# Altium schematic sheet Beam_Amp.SchDoc
size Tabloid
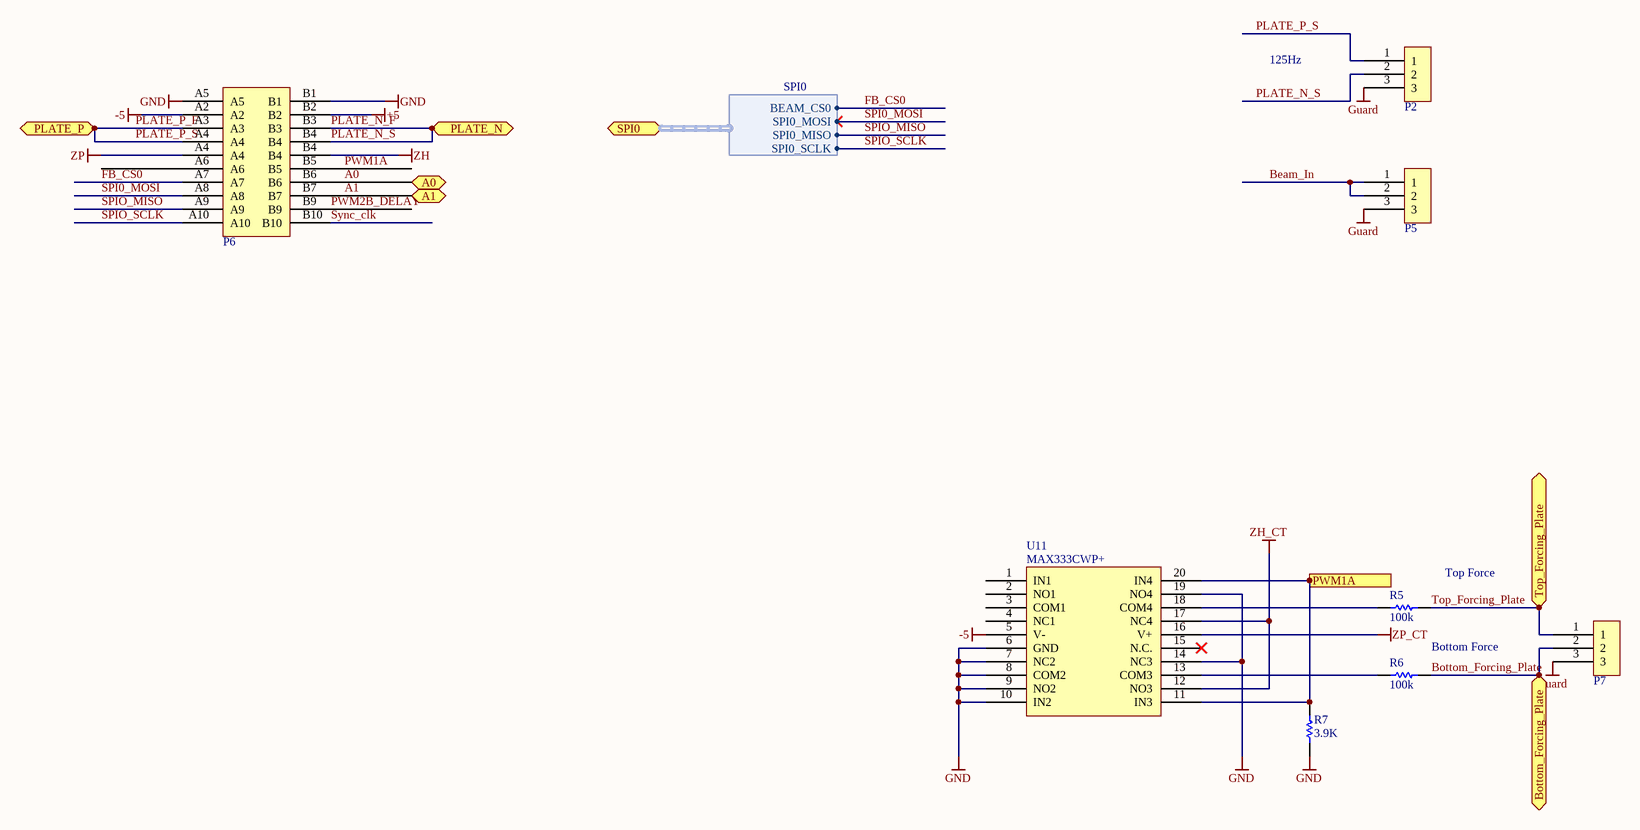
[diagram p0: Beam_Amp.SchDoc]

## Parts
P2  Triax_Conn  [Triax_Conn]  (value not drawn)
P5  Triax_Conn  [Triax_Conn]  (value not drawn)
P6  MEC6-110-0-PCB  [MEC6-110-02-L-DV]  (value not drawn)
P7  Triax_Conn  [Triax_Conn]  (value not drawn)
R5  100k  [RESC0402(1005)_M]
R6  100k  [RESC0402(1005)_M]
R7  3.9K  [RESC0402(1005)_M]
U11  MAX333CWP+  [TSOP65P640X90-20N]

## Ports
A0, A1, Bottom_Forcing_Plate, PLATE_N, PLATE_P, PWM1A, SPI0 (harness SPI0), Top_Forcing_Plate

## Harnesses
SPI0: BEAM_CS0, SPI0_MOSI, SPI0_MISO, SPI0_SCLK

## Nets
+5: P6.B2
-5: P6.A2 U11.5(V-)
GND: P6.A5 P6.B1 R7.1 U11.6(GND) U11.7(NC2) U11.8(COM2) U11.9(NO2) U11.10(IN2) U11.14(NC3) U11.19(NO4)
Guard: P2.3 P5.3 P7.3
ZH: P6.B4
ZH_CT: U11.12(NO3) U11.17(NC4)
ZP: P6.A4
ZP_CT: U11.16(V+)
A0: P6.B6 ; port A0
A1: P6.B7 ; port A1
Beam_In: P5.1 P5.2
Bottom_Forcing_Plate: P7.2 R6.1 ; port Bottom_Forcing_Plate
FB_CS0: P6.A7 ; port SPI0.BEAM_CS0
PLATE_N_F: P2.2 P6.B3 P6.B4 ; port PLATE_N  [also labelled PLATE_N_S]
PLATE_P_F: P2.1 P6.A3 P6.A4 ; port PLATE_P  [also labelled PLATE_P_S]
PWM1A: R7.2 U11.11(IN3) U11.20(IN4) ; port PWM1A
PWM1A: P6.B5  [a separate net that carries the same name]
PWM2B_DELAY: P6.B9
SPI0_MOSI: P6.A8 ; port SPI0.SPI0_MOSI
SPIO_MISO: P6.A9 ; port SPI0.SPI0_MISO
SPIO_SCLK: P6.A10 ; port SPI0.SPI0_SCLK
Sync_clk: P6.B10
Top_Forcing_Plate: P7.1 R5.1 ; port Top_Forcing_Plate
NetR5_2: R5.2 U11.18(COM4)
NetR6_2: R6.2 U11.13(COM3)

Not connected (* = marked no-connect by the designer): P6 A6; U11 1(IN1) 2(NO1) 3(COM1) 4(NC1) 15(N.C.)*

## Notes on the sheet
- 125Hz
- (near R5) Top Force
- Bottom Force
- Title
- Size:
- Date:
- Tabloid
- Number:
- Time:
- Revision:
- Sheet
- of
- ZLS Corporation
- 7801 North Lamar Blvd.
- Suite E-184
- Austin, Texas 78752  USA
- (512) 453-0288
- File:

## Library data of the parts
R5 R6 = CMP-1011-00651-1
R7 = CMP-1011-00463-1
U11 = MAX333CWP+: IC SWITCH QUAD SPDT 20TSSOP; Manufacturer: Maxim; Manufacturer Part Number: MAX333AEUP+; Max Supply Voltage: 30V; Min Supply Voltage: 10V; Min Dual Supply Voltage: 4.5V; Max Dual Supply Voltage: 20V; On-State Resistance: 35R; Operating Supply Current: 1uA; Supply Type: Single,Dual; Max Power Dissipation: 559mW; Turn-On Delay Time: 175ns; Turn-Off Delay Time: 145ns; Max Supply Current: 250uA; Number of Bits: 4; Dual Supply Voltage: 15V; Supplier 1: Mouser; Supplier Part Number 1: 700-MAX333AEUP; Stock 1: 664; Pricing 1: 1=6.77, 10=6.43, 50=5.8, 100=5.8, 1000=5.62, 10000=5.62 (USD); Case/Package: TSSOP; Number of Pins: 20; Weight: 0.006737oz; Min Operating Temperature: -40°C; Max Operating Temperature: 85°C; Packaging: Rail/Tube; Package Quantity: 74; Throw Configuration: SPDT; Number of Channels: 4; Length: 6.6mm; Height: 0.95mm; Width: 4.5mm; Radiation Hardening: No; Lead Free: Lead Free; REACH SVHC: Unknown; ComponentLink1URL: https://datasheet.ciiva.com/2978/max333a-2978850.pdf; ComponentLink1Description: https://datasheet.ciiva.com/2978/max333a-2978850.pdf; ComponentLink2URL: https://datasheet.ciiva.com/30478/0900766b81253c85-30478260.pdf; ComponentLink2Description: https://datasheet.ciiva.com/30478/0900766b81253c85-30478260.pdf; ComponentLink3URL: https://datasheet.ciiva.com/1674/max333a-1674617.pdf; ComponentLink3Description: https://datasheet.ciiva.com/1674/max333a-1674617.pdf; ComponentLink4URL: https://datasheet.ciiva.com/26825/max333aeup-26825546.pdf; ComponentLink4Description: https://datasheet.ciiva.com/26825/max333aeup-26825546.pdf